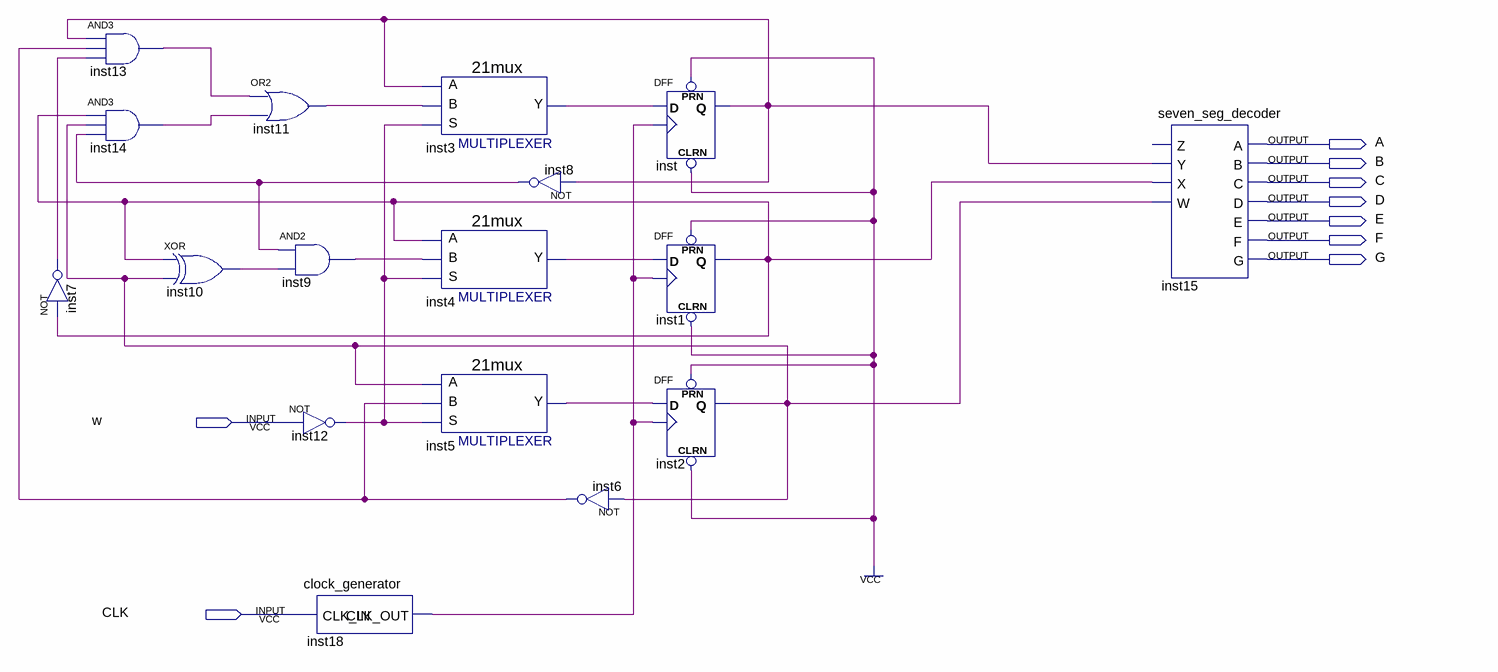
[diagram p0: schematic sheet]
// Quartus schematic lab11step1.bdf as structural Verilog: 17 symbols, 9 pins
module lab11step1 (
  input  w,
  input  CLK,
  output A,
  output B,
  output C,
  output D,
  output E,
  output F,
  output G
);

  wire inst1_q, inst2_q, inst3_y, inst4_y, inst5_y, inst6_out, inst7_out, inst8_out, inst9_out, inst10_out,
       inst11_out, inst12_out, inst13_out, inst14_out, inst18_clk_out, inst_q;

  and inst13 (inst13_out, inst_q, inst6_out, inst7_out);
  and inst14 (inst14_out, inst1_q, inst2_q, inst8_out);
  not inst7 (inst7_out, inst1_q);
  xor inst10 (inst10_out, inst1_q, inst2_q);
  or inst11 (inst11_out, inst13_out, inst14_out);
  and inst9 (inst9_out, inst8_out, inst10_out);
  not inst12 (inst12_out, w);
  clock_generator inst18 (.CLK_IN(CLK), .CLK_OUT(inst18_clk_out));
  \21mux  inst3 (.S(inst12_out), .B(inst11_out), .A(inst_q), .Y(inst3_y));
  \21mux  inst4 (.S(inst12_out), .B(inst9_out), .A(inst1_q), .Y(inst4_y));
  \21mux  inst5 (.S(inst12_out), .B(inst6_out), .A(inst2_q), .Y(inst5_y));
  not inst8 (inst8_out, inst_q);
  not inst6 (inst6_out, inst2_q);
  DFF inst (.CLRN(1'b1), .CLK(inst18_clk_out), .D(inst3_y), .PRN(1'b1), .Q(inst_q));
  DFF inst1 (.CLRN(1'b1), .CLK(inst18_clk_out), .D(inst4_y), .PRN(1'b1), .Q(inst1_q));
  DFF inst2 (.CLRN(1'b1), .CLK(inst18_clk_out), .D(inst5_y), .PRN(1'b1), .Q(inst2_q));
  seven_seg_decoder inst15 (
    .Y(inst_q), .X(inst1_q), .W(inst2_q), .A(A), .B(B), .C(C), .D(D), .E(E), .F(F), .G(G));  // open: Z
endmodule
